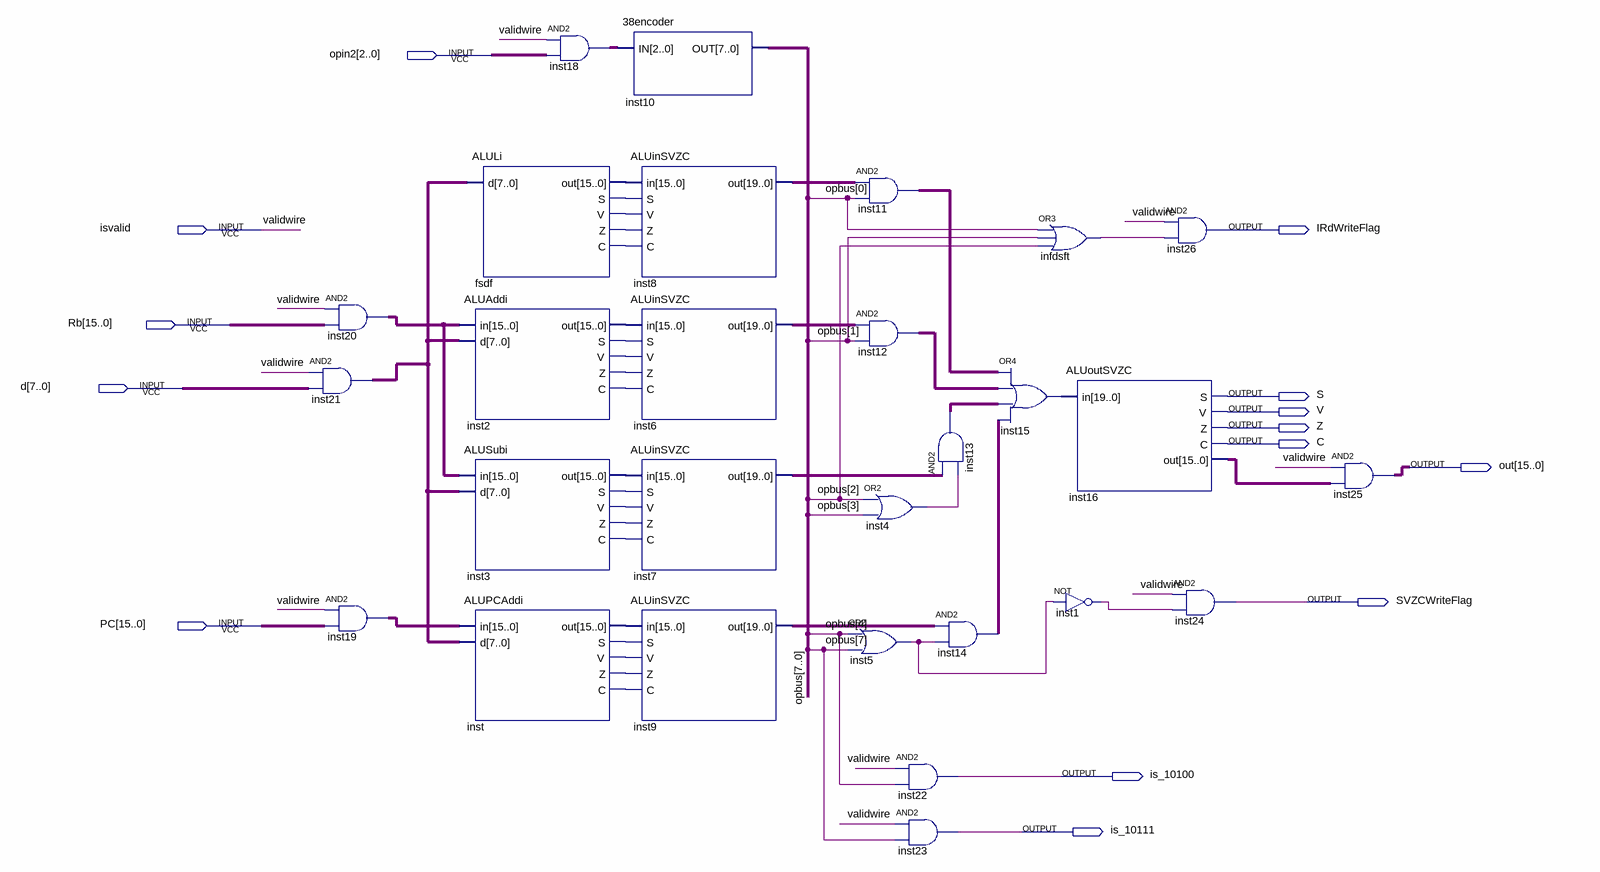
[diagram p0: schematic sheet]
// Quartus schematic LI_B.bdf as structural Verilog: 28 symbols, 14 pins
module LI_B (
  input  [2:0] opin2,
  input  isvalid,
  input  [15:0] Rb,
  input  [7:0] d,
  input  [15:0] PC,
  output IRdWriteFlag,
  output S,
  output V,
  output Z,
  output C,
  output [15:0] out,
  output SVZCWriteFlag,
  output is_10100,
  output is_10111
);

  wire fsdf_c, fsdf_s, fsdf_v, fsdf_z, infdsft_out, inst1_out, inst2_c, inst2_s, inst2_v, inst2_z, inst3_c,
       inst3_s, inst3_v, inst3_z, inst4_out, inst5_out, inst_c, inst_s, inst_v, inst_z;
  wire [2:0] inst18_out;
  wire [7:0] inst21_out, opbus;
  wire [15:0] fsdf_out, inst2_out, inst3_out, inst16_out, inst19_out, inst20_out, inst_out;
  wire [19:0] inst6_out, inst7_out, inst8_out, inst9_out, inst11_out, inst12_out, inst13_out, inst14_out,
       inst15_out;

  assign inst20_out = {16{isvalid}} & Rb;  // AND2 inst20, 16 bits wide
  assign inst21_out = {8{isvalid}} & d;  // AND2 inst21, 8 bits wide
  assign inst19_out = {16{isvalid}} & PC;  // AND2 inst19, 16 bits wide
  ALULi fsdf (.d(inst21_out), .out(fsdf_out), .S(fsdf_s), .V(fsdf_v), .Z(fsdf_z), .C(fsdf_c));
  ALUAddi inst2 (.in(inst20_out), .d(inst21_out), .out(inst2_out), .S(inst2_s), .V(inst2_v), .Z(inst2_z), .C(inst2_c));
  ALUSubi inst3 (.in(inst20_out), .d(inst21_out), .out(inst3_out), .S(inst3_s), .V(inst3_v), .Z(inst3_z), .C(inst3_c));
  ALUPCAddi inst (.in(inst19_out), .d(inst21_out), .out(inst_out), .S(inst_s), .V(inst_v), .Z(inst_z), .C(inst_c));
  assign inst18_out = {3{isvalid}} & opin2;  // AND2 inst18, 3 bits wide
  \38encoder  inst10 (.IN(inst18_out), .OUT(opbus));
  ALUinSVZC inst8 (.in(fsdf_out), .S(fsdf_s), .V(fsdf_v), .Z(fsdf_z), .C(fsdf_c), .out(inst8_out));
  ALUinSVZC inst6 (.in(inst2_out), .S(inst2_s), .V(inst2_v), .Z(inst2_z), .C(inst2_c), .out(inst6_out));
  ALUinSVZC inst7 (.in(inst3_out), .S(inst3_s), .V(inst3_v), .Z(inst3_z), .C(inst3_c), .out(inst7_out));
  ALUinSVZC inst9 (.in(inst_out), .S(inst_s), .V(inst_v), .Z(inst_z), .C(inst_c), .out(inst9_out));
  or inst5 (inst5_out, opbus[4], opbus[7]);
  assign inst11_out = inst8_out & {20{opbus[0]}};  // AND2 inst11, 20 bits wide
  assign inst12_out = inst6_out & {20{opbus[1]}};  // AND2 inst12, 20 bits wide
  or inst4 (inst4_out, opbus[2], opbus[3]);
  and inst22 (is_10100, isvalid, opbus[4]);
  and inst23 (is_10111, isvalid, opbus[7]);
  assign inst13_out = inst7_out & {20{inst4_out}};  // AND2 inst13, 20 bits wide
  assign inst14_out = inst9_out & {20{inst5_out}};  // AND2 inst14, 20 bits wide
  or infdsft (infdsft_out, opbus[0], opbus[1], opbus[2]);
  assign inst15_out = inst11_out | inst12_out | inst13_out | inst14_out;  // OR4 inst15, 20 bits wide
  ALUoutSVZC inst16 (.in(inst15_out), .S(S), .V(V), .Z(Z), .C(C), .out(inst16_out));
  not inst1 (inst1_out, inst5_out);
  and inst26 (IRdWriteFlag, isvalid, infdsft_out);
  and inst24 (SVZCWriteFlag, isvalid, inst1_out);
  assign out = {16{isvalid}} & inst16_out;  // AND2 inst25, 16 bits wide

  // Other names for the same wires on the sheet: validwire = isvalid
endmodule
